# EAGLE design skematik projek mikro (EAGLE 9.6.2)
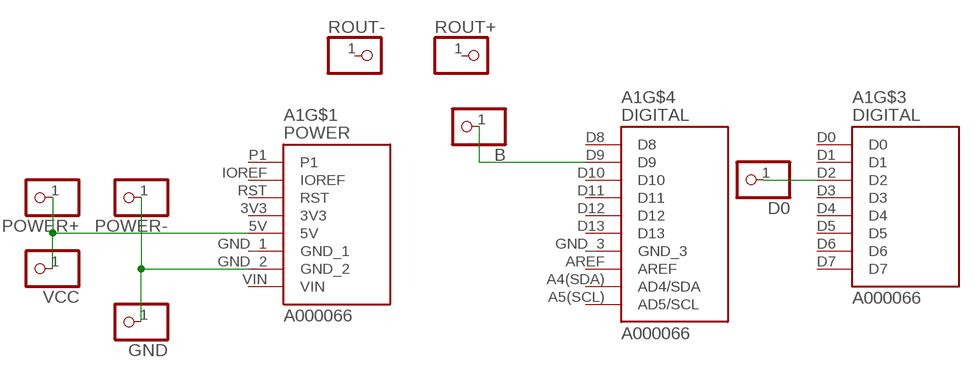
[diagram p0: schematic, sheet 1]

## Parts
A1  A000066  [ARDUINO_A000066]
B  PINHD-1X1  [1X01]
D0  PINHD-1X1  [1X01]
GND  PINHD-1X1  [1X01]
POWER+  PINHD-1X1  [1X01]
POWER-  PINHD-1X1  [1X01]
ROUT+  PINHD-1X1  [1X01]
ROUT-  PINHD-1X1  [1X01]
VCC  PINHD-1X1  [1X01]

## Nets
N$1: A1.5V POWER+.1 VCC.1
N$2: A1.GND_2 GND.1 POWER-.1
N$4: A1.D2 D0.1
N$5: A1.D9 B.1
Unconnected: A1.A0 A1.A1 A1.A2 A1.A3 A1.A4 A1.A4(SDA)(AD4/SDA) A1.A5 A1.A5(SCL)(AD5/SCL) A1.AREF A1.D0 A1.D1 A1.D3 A1.D4 A1.D5 A1.D6 A1.D7 A1.D8 A1.D10 A1.D11 A1.D12 A1.D13 A1.IOREF A1.P1 A1.RST ROUT+.1 ROUT-.1

## Power pins joined to a net without a drawn wire
3V3: A1.3V3
GND_1: A1.GND_1
GND_3: A1.GND_3
VIN: A1.VIN

## Library data of the parts
A1 = A000066:A000066: Microcontroller board, Uno [Arduino] A000066 Microcontroller board, Uno 7640152110092 Check prices <https://pricing.snapeda.com/parts/A000066/Arduino/view-part?ref=eda> Check prices <https://pricing.snapeda.com/parts/A000066/Arduino/view-part?ref=eda> Check availability <https://pricing.snapeda.com/parts/ARDUINO%20UNO%20REV3/Arduino/view-part?ref=eda>; AVAILABILITY: In Stock; CHECK_PRICES: https://www.snapeda.com/parts/ARDUINO%20UNO%20REV3/Arduino/view-part/?ref=eda; DESCRIPTION: Microcontroller board based on the ATmega328P.; MF: Arduino; MP: ARDUINO UNO REV3; PACKAGE: Non-Standard Arduino; PRICE: None; SNAPEDA_LINK: https://www.snapeda.com/parts/ARDUINO%20UNO%20REV3/Arduino/view-part/?ref=snap
B D0 GND POWER+ POWER- ROUT+ ROUT- VCC = pinhead:PINHD-1X1: PIN HEADER

## Board
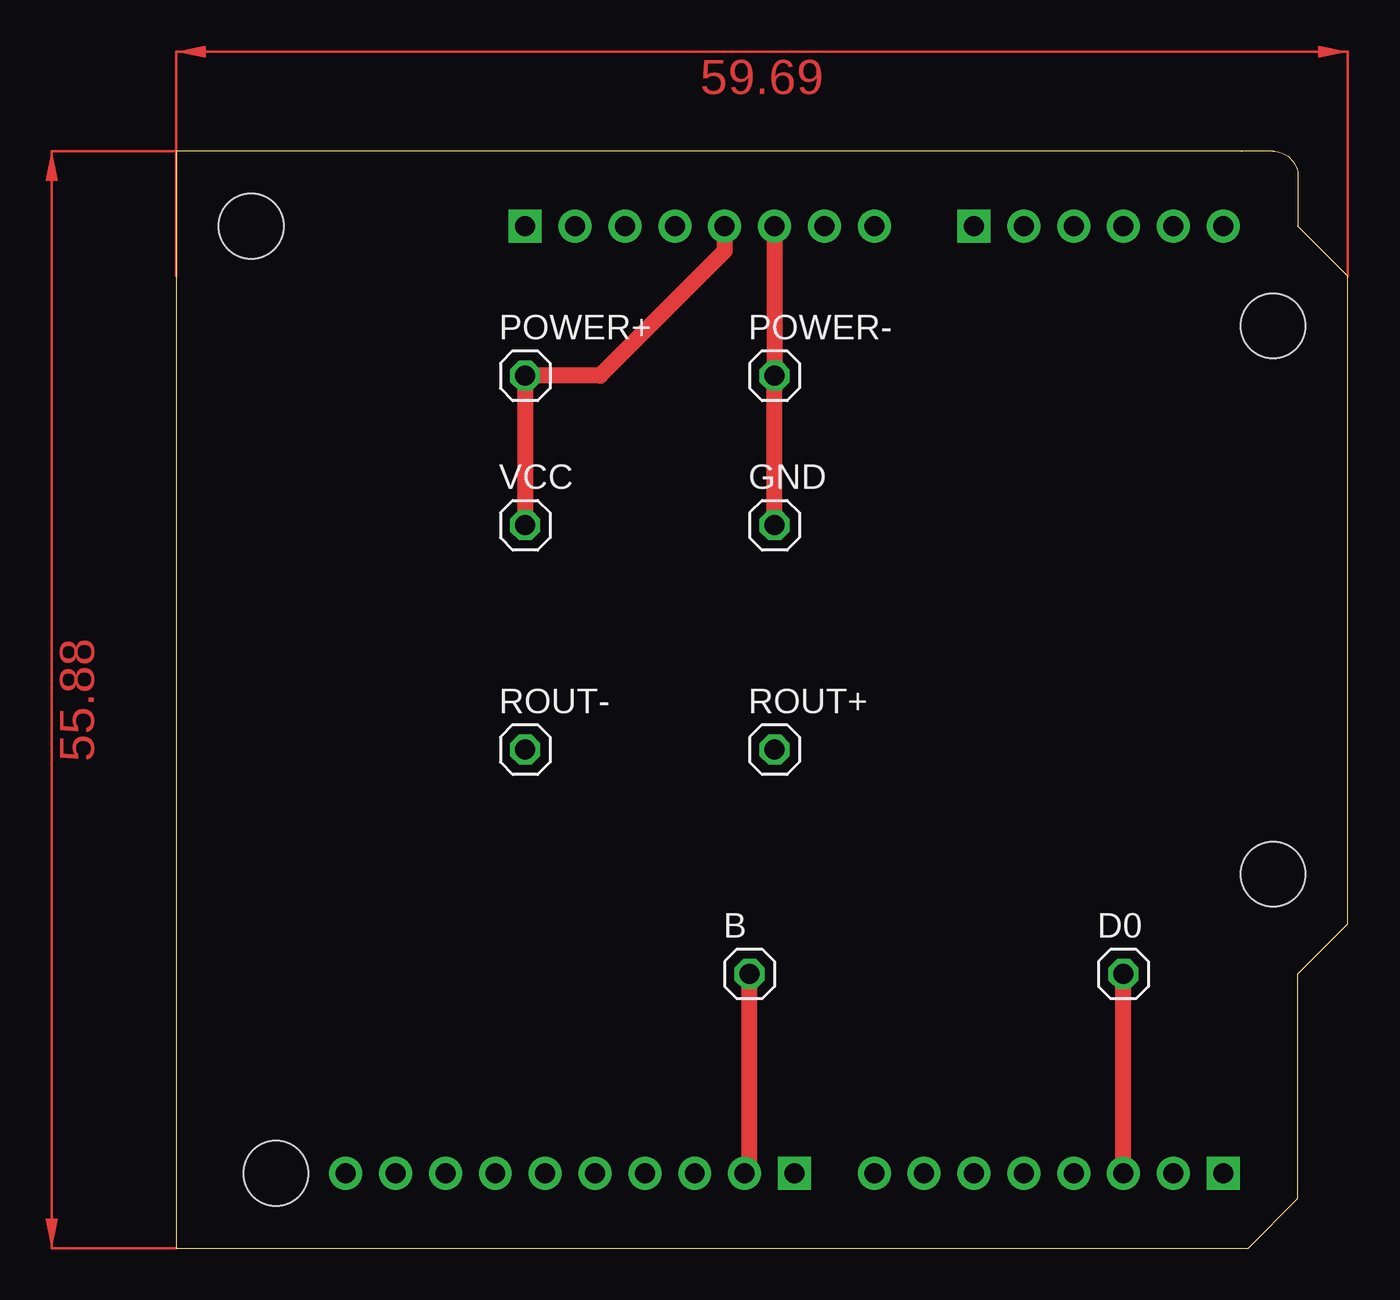
[diagram p1: board, top side]
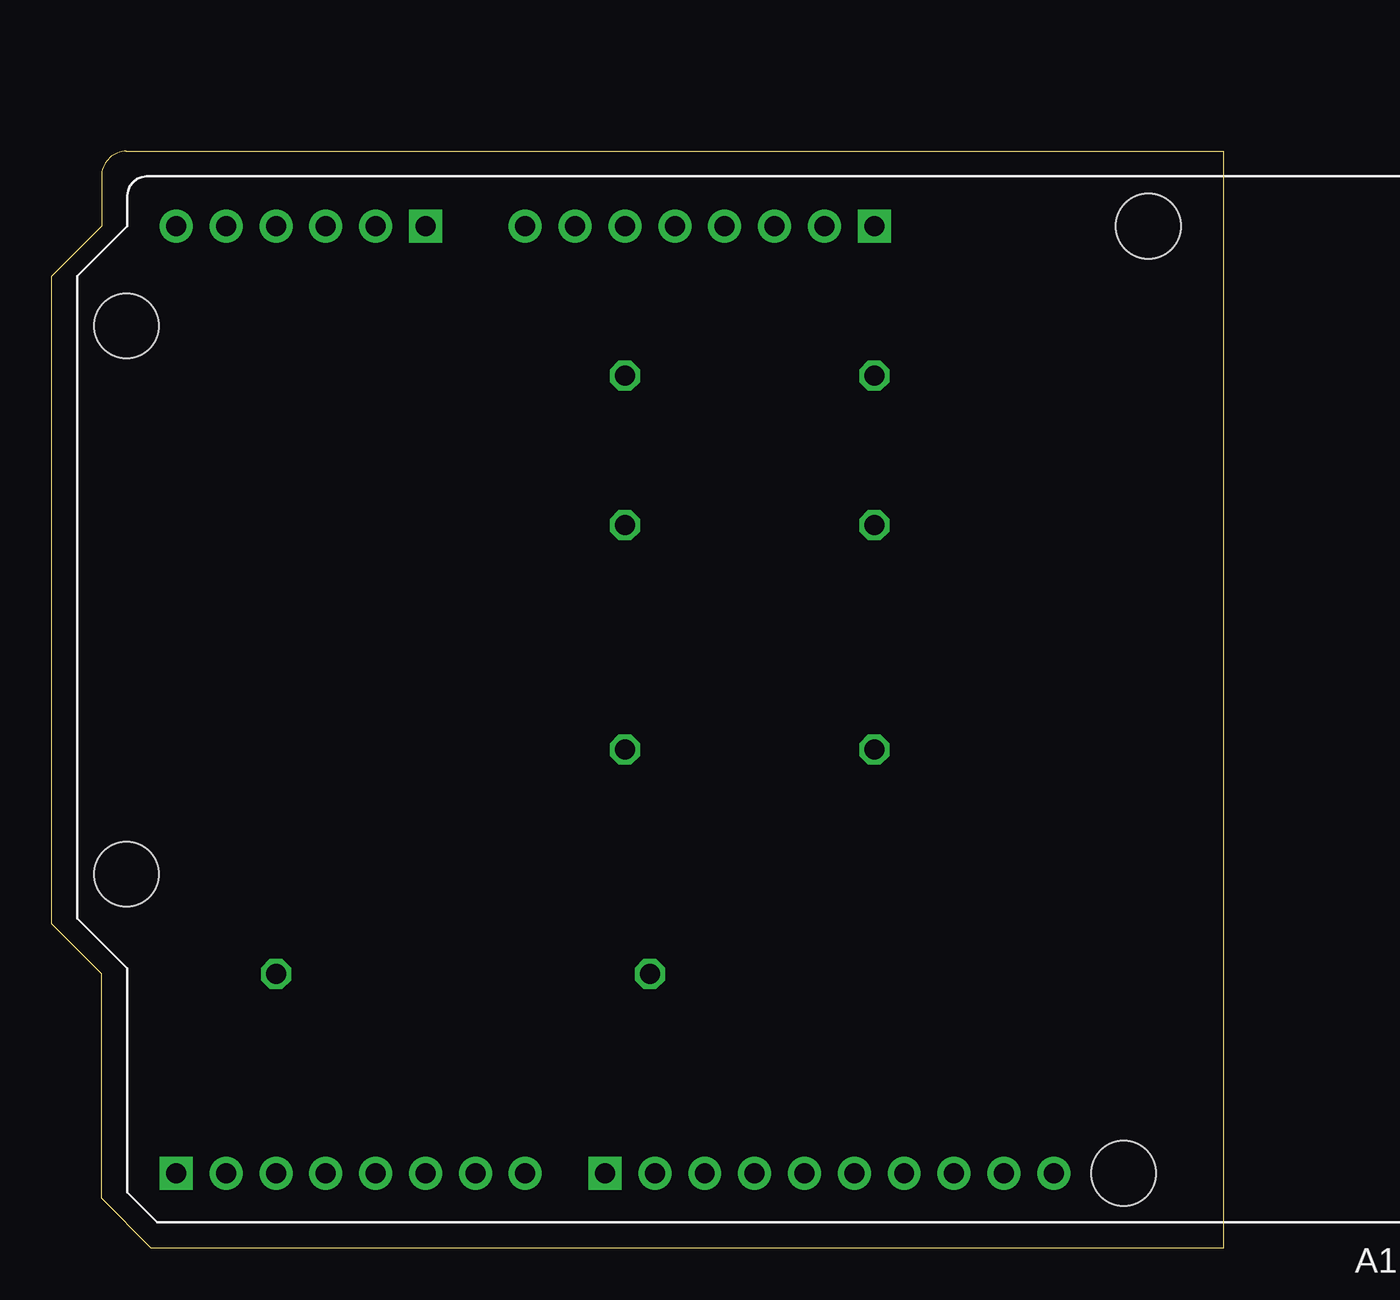
[diagram p2: board, bottom side, seen from below]

Size 59.69 x 55.88 mm. Coordinates in mm from the lower left corner, seen from the top.
Outline: 55.88,55.88 arc-90 57.15,54.61 57.15,52.07 59.69,49.53 59.69,16.51 57.15,13.97 57.15,2.54 54.61,0 0,0 0,55.88 54.29,55.88
Outline: 54.28,55.87 arc-90 54.29,55.88
Outline: 55.89,55.87 55.88,55.88
Outline: 55.88,55.88 54.29,55.88
Outline: 8.89,55.88 7.62,55.88
Copper layers (1*16): Top 0.035mm / dielectric 1.5mm / Bottom 0.035mm
Design rules "default": minimum track width 6mil, minimum drill 0.35mm, track to track 6mil, track to pad 6mil, pad to pad 6mil, via to via 6mil, smd to smd 6mil, copper to edge 40mil, drill to drill 6mil, minimum pad ring 10mil, minimum via ring 8mil, stop-mask expansion 4mil, vias tented up to drill 0mil, thermal gap 10mil

### Footprints (pad centres in the part's own frame; a part is rotated, then mirrored left to right if it is on the bottom)
ARDUINO_A000066 = drill 1.016 pad 1.676: 3V3 35.56,2.54; 5V 38.1,2.54; A1 53.34,2.54; A2 55.88,2.54; A3 58.42,2.54; A4 60.96,2.54; A4(SDA) 21.336,50.8; A5 63.5,2.54; A5(SCL) 18.796,50.8; AREF 23.876,50.8; D1 60.96,50.8; D2 58.42,50.8; D3 55.88,50.8; D4 53.34,50.8; D5 50.8,50.8; D6 48.26,50.8; D7 45.72,50.8; D9 39.116,50.8; D10 36.576,50.8; D11 34.036,50.8; D12 31.496,50.8; D13 28.956,50.8; GND_1 43.18,2.54; GND_2 40.64,2.54; GND_3 26.416,50.8; IOREF 30.48,2.54; RST 33.02,2.54; VIN 45.72,2.54 | drill 1.016 pad 1.676 square: A0 50.8,2.54; D0 63.5,50.8; D8 41.656,50.8; P1 27.94,2.54 | hole 3.3: 66.04,35.56; 66.04,7.62; 15.24,50.8; 13.97,2.54
1X01 = drill 1.016 octagon: 1 0,0

### Placement (x,y rotation side)
A1  -10.16,54.61 180 bottom
B  29.21,13.97 0 top
D0  48.26,13.97 0 top
GND  30.48,36.83 0 top
POWER+  17.78,44.45 0 top
POWER-  30.48,44.45 0 top
ROUT+  30.48,25.4 0 top
ROUT-  17.78,25.4 0 top
VCC  17.78,36.83 0 top

### Tracks (layer width: path | path; a pad name or v marks a point on that pad's centre or on a via)
N$1
  Top 0.813: A1.5V 27.94,50.8 21.59,44.45 POWER+.1 VCC.1
N$2
  Top 0.813: A1.GND_2 POWER-.1 GND.1
N$4
  Top 0.813: A1.D2 D0.1
N$5
  Top 0.813: A1.D9 29.21,4.06 B.1
(copper drawn outside any net)
  shapes: Top area x2